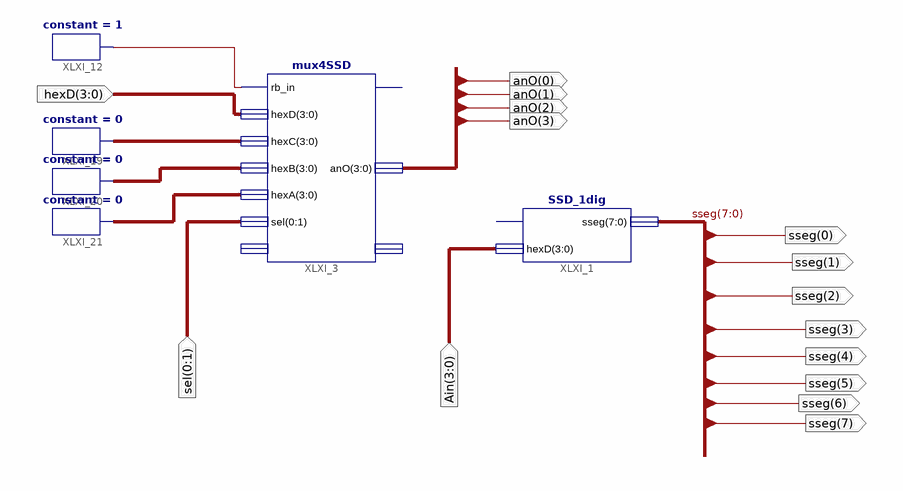
[diagram p0: schematic sheet 1]
// Xilinx ISE schematic Experiment2.sch (spartan3e) as structural Verilog: 6 symbols, 15 ports
module Experiment2 (
  input  [0:1] sel,
  input  [3:0] hexD,
  input  [3:0] Ain,
  output [7:0] sseg,
  output [3:0] anO
);

  wire rb_in;
  wire [3:0] hexA, hexB, hexC;

  mux4SSD XLXI_3 (
    .rb_in(rb_in), .hexD(hexD), .hexC(hexC), .hexB(hexB), .hexA(hexA), .sel(sel), .anO(anO));  // open: dp_in, dpO, hexO
  SSD_1dig XLXI_1 (.hexD(Ain), .sseg(sseg));  // open: dp_in
  constant #(.CValue("1")) XLXI_12 (.O(rb_in));
  constant #(.CValue("0")) XLXI_19 (.O(hexC));
  constant #(.CValue("0")) XLXI_20 (.O(hexB));
  constant #(.CValue("0")) XLXI_21 (.O(hexA));
endmodule
